# Altium schematic sheet Sheet1.SchDoc
size A4
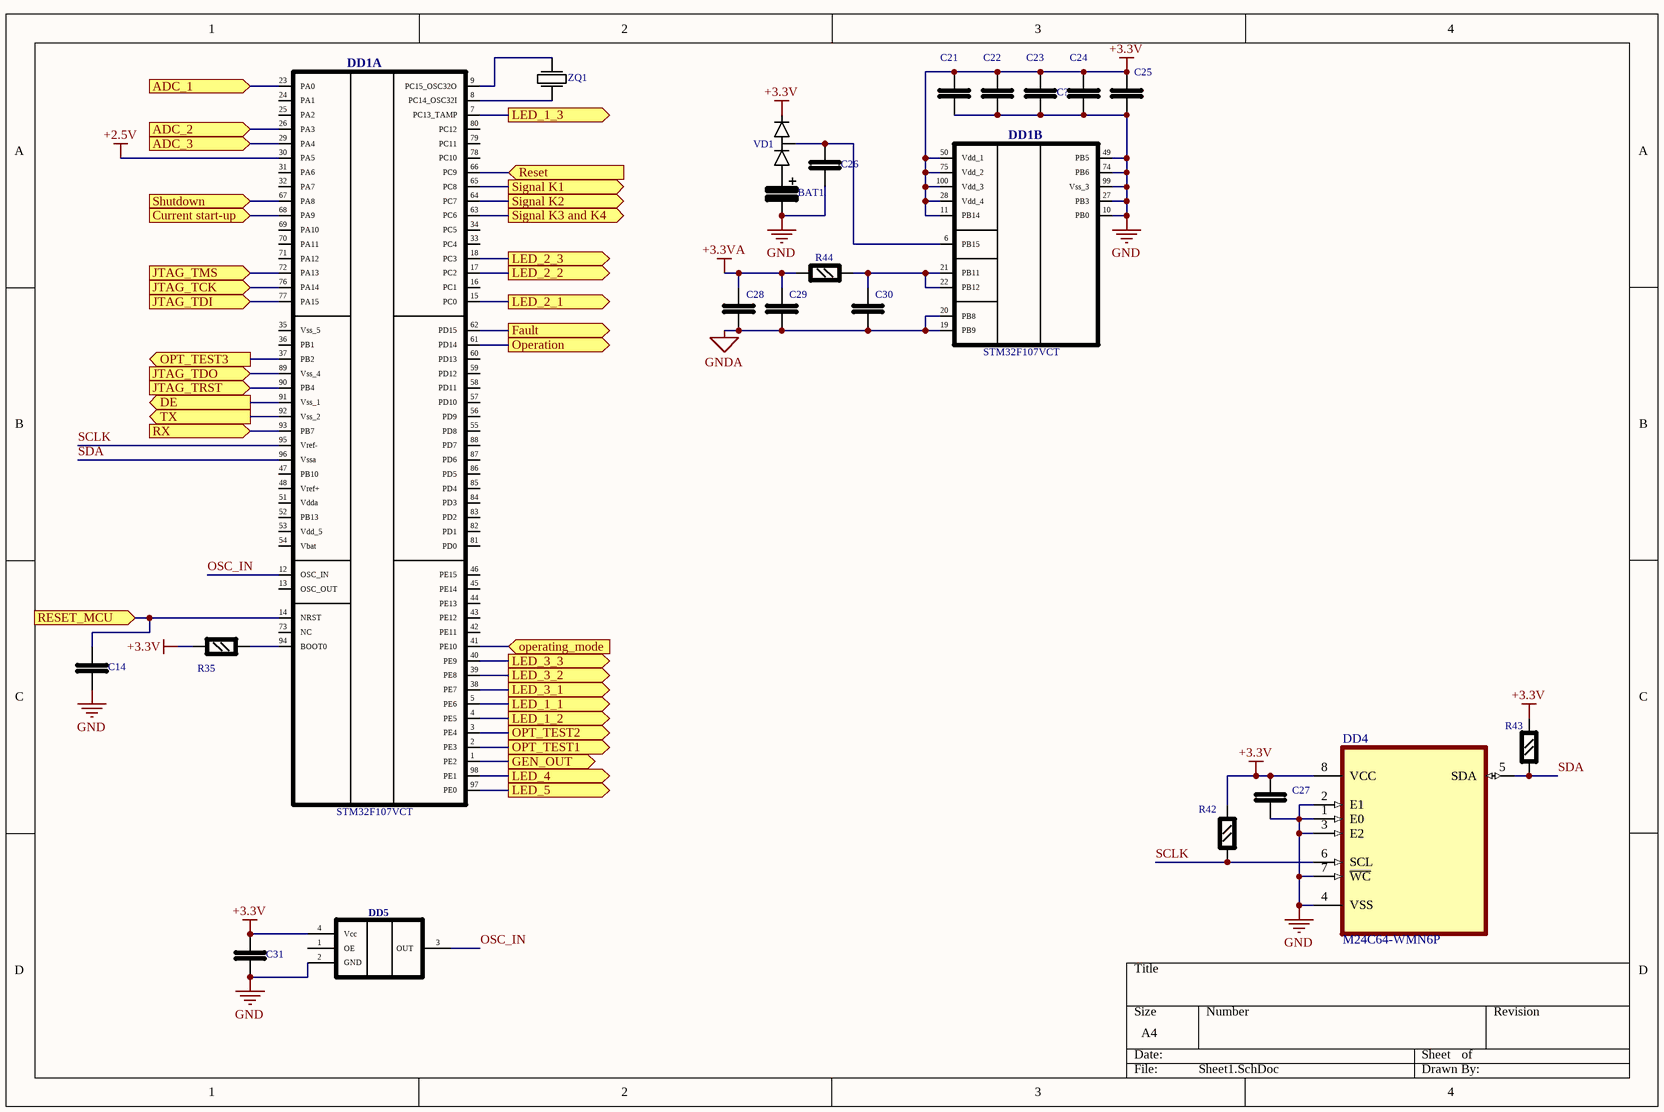
[diagram p0: Sheet1.SchDoc]

## Parts
BAT1  ER14250-VY_BATT  [ER14250-VY_BATT_ER14250-VY_BATT(Primary)]  (value not drawn)
C14  CAP_0805  [CAP_0805]  (value not drawn)
C21  CAP_0805  [CAP_0805]  (value not drawn)
C22  CAP_0805  [CAP_0805]  (value not drawn)
C23  CAP_0805  [CAP_0805]  (value not drawn)
C24  CAP_0805  [CAP_0805]  (value not drawn)
C25  CAP_0805  [CAP_0805]  (value not drawn)
C26  CAP_0805  [CAP_0805]  (value not drawn)
C27  CAP_0805  [CAP_0805]  (value not drawn)
C28  CAP_0805  [CAP_0805]  (value not drawn)
C29  CAP_0805  [CAP_0805]  (value not drawn)
C30  CAP_0805  [CAP_0805]  (value not drawn)
C31  CAP_0805  [CAP_0805]  (value not drawn)
C?  CAP_0805  [CAP_0805]  (value not drawn)
DD1  STM32F107VCT  [STM32F107VCT]  (parts A,B of 2)
DD4  M24C64-WMN6P  [SOIC127P600X175-8N]
DD5  KXO-V97  [KXO-V97]  (value not drawn)
R35  RES_0805  [RES_0805]  (value not drawn)
R42  RES_0805  [RES_0805]  (value not drawn)
R43  RES_0805  [RES_0805]  (value not drawn)
R44  RES_0805  [RES_0805]  (value not drawn)
VD1  BAV99  [SOT_23_1]  (value not drawn)
ZQ1  MC306  [MC306_MC306(Primary)]  (value not drawn)

## Ports
ADC_1 (in), ADC_2 (in), ADC_3 (in), Current start-up (in), DE (out), Fault (out), GEN_OUT (out), JTAG_TCK (in), JTAG_TDI (in), JTAG_TDO (in), JTAG_TMS (in), JTAG_TRST (in), LED_1_1 (out), LED_1_2 (out), LED_1_3 (out), LED_2_1 (out), LED_2_2 (out), LED_2_3 (out), LED_3_1 (out), LED_3_2 (out), LED_3_3 (out), LED_4 (out), LED_5 (out), operating_mode (in), Operation (out), OPT_TEST1 (out), OPT_TEST2 (out), OPT_TEST3 (out), Reset (in), RESET_MCU (in), RX (in), Shutdown (in), Signal K1 (out), Signal K2 (out), Signal K3 and K4 (out), TX (out)

## Nets
+2.5V: DD1.30(PA5)
+3.3V: C21.2(D2) C22.2(D2) C23.2(D2) C24.2(D2) C25.2(D2) C27.2(D2) C31.2(D2) C?.2(D2) DD1.11(PB14) DD1.28(Vdd_4) DD1.50(Vdd_1) DD1.75(Vdd_2) DD1.100(Vdd_3) DD4.8(VCC) DD5.4(Vcc) R35.1(D1) R42.2(D2) R43.2(D2) VD1.2(catod)
+3.3VA: C28.2(D2) C29.2(D2) R44.1(D1)
GND: BAT1.Minus(D2) C14.1(D1) C21.1(D1) C22.1(D1) C23.1(D1) C24.1(D1) C25.1(D1) C26.1(D1) C27.1(D1) C31.1(D1) C?.1(D1) DD1.10(PB0) DD1.27(PB3) DD1.49(PB5) DD1.74(PB6) DD1.99(Vss_3) DD4.1(E0) DD4.2(E1) DD4.3(E2) DD4.4(VSS) DD4.7(~{WC}) DD5.2(GND)
GNDA: C28.1(D1) C29.1(D1) C30.1(D1) DD1.19(PB9) DD1.20(PB8)
ADC_1: DD1.23(PA0) ; port ADC_1
ADC_2: DD1.26(PA3) ; port ADC_2
ADC_3: DD1.29(PA4) ; port ADC_3
Current start-up: DD1.68(PA9) ; port Current start-up
DE: DD1.91(Vss_1) ; port DE
Fault: DD1.62(PD15) ; port Fault
GEN_OUT: DD1.1(PE2) ; port GEN_OUT
JTAG_TCK: DD1.76(PA14) ; port JTAG_TCK
JTAG_TDI: DD1.77(PA15) ; port JTAG_TDI
JTAG_TDO: DD1.89(Vss_4) ; port JTAG_TDO
JTAG_TMS: DD1.72(PA13) ; port JTAG_TMS
JTAG_TRST: DD1.90(PB4) ; port JTAG_TRST
LED_1_1: DD1.5(PE6) ; port LED_1_1
LED_1_2: DD1.4(PE5) ; port LED_1_2
LED_1_3: DD1.7(PC13_TAMP) ; port LED_1_3
LED_2_1: DD1.15(PC0) ; port LED_2_1
LED_2_2: DD1.17(PC2) ; port LED_2_2
LED_2_3: DD1.18(PC3) ; port LED_2_3
LED_3_1: DD1.38(PE7) ; port LED_3_1
LED_3_2: DD1.39(PE8) ; port LED_3_2
LED_3_3: DD1.40(PE9) ; port LED_3_3
LED_4: DD1.98(PE1) ; port LED_4
LED_5: DD1.97(PE0) ; port LED_5
operating_mode: DD1.41(PE10) ; port operating_mode
Operation: DD1.61(PD14) ; port Operation
OPT_TEST1: DD1.2(PE3) ; port OPT_TEST1
OPT_TEST2: DD1.3(PE4) ; port OPT_TEST2
OPT_TEST3: DD1.37(PB2) ; port OPT_TEST3
OSC_IN: DD1.12(OSC_IN) DD5.3(OUT)
Reset: DD1.66(PC9) ; port Reset
RESET_MCU: C14.2(D2) DD1.14(NRST) ; port RESET_MCU
RX: DD1.93(PB7) ; port RX
SCLK: DD1.95(Vref-) DD4.6(SCL) R42.1(D1)
SDA: DD1.96(Vssa) DD4.5(SDA) R43.1(D1)
Shutdown: DD1.67(PA8) ; port Shutdown
Signal K1: DD1.65(PC8) ; port Signal K1
Signal K2: DD1.64(PC7) ; port Signal K2
Signal K3 and K4: DD1.63(PC6) ; port Signal K3 and K4
TX: DD1.92(Vss_2) ; port TX
NetBAT1_Plus: BAT1.Plus(D1) VD1.1(anod)
NetC26_2: C26.2(D2) DD1.6(PB15) VD1.3(ca)
NetC30_2: C30.2(D2) DD1.21(PB11) DD1.22(PB12) R44.2(D2)
NetDD1_8: DD1.8(PC14_OSC32I) ZQ1.2(D2)
NetDD1_9: DD1.9(PC15_OSC32O) ZQ1.1(D1)
NetDD1_94: DD1.94(BOOT0) R35.2(D2)

Not connected (* = marked no-connect by the designer): DD1 13(OSC_OUT) 16(PC1) 24(PA1) 25(PA2) 31(PA6) 32(PA7) 33(PC4) 34(PC5) 35(Vss_5) 36(PB1) 42(PE11) 43(PE12) 44(PE13) 45(PE14) 46(PE15) 47(PB10) 48(Vref+) 51(Vdda) 52(PB13) 53(Vdd_5) 54(Vbat) 55(PD8) 56(PD9) 57(PD10) 58(PD11) 59(PD12) 60(PD13) 69(PA10) 70(PA11) 71(PA12) 73(NC) 78(PC10) 79(PC11) 80(PC12) 81(PD0) 82(PD1) 83(PD2) 84(PD3) 85(PD4) 86(PD5) 87(PD6) 88(PD7); DD5 1(OE)

## Library data of the parts
DD4 = M24C64-WMN6P: EEPROM Memory IC 64Kb (8K x 8) IÂ²C 1MHz 450ns 8-SO; MF: STMicroelectronics; Price: None; SnapEDA_Link: https://www.snapeda.com/parts/M24C64-WMN6P/STMicroelectronics/view-part/305317/?ref=snap; Availability: Unavailable; MP: M24C64-WMN6P; Value: *; Package: SO-8 STMicroelectronics
BAT1 = ER14250-VY_BATT: Value: *
C14 C21-C31 C? = CAP_0805: Value: *
DD1 = STM32F107VCT: Value: *
DD5 = KXO-V97: Value: *
R35 R42-R44 = RES_0805: Value: *
VD1 = BAV99: Value: *
ZQ1 = MC306: Value: *